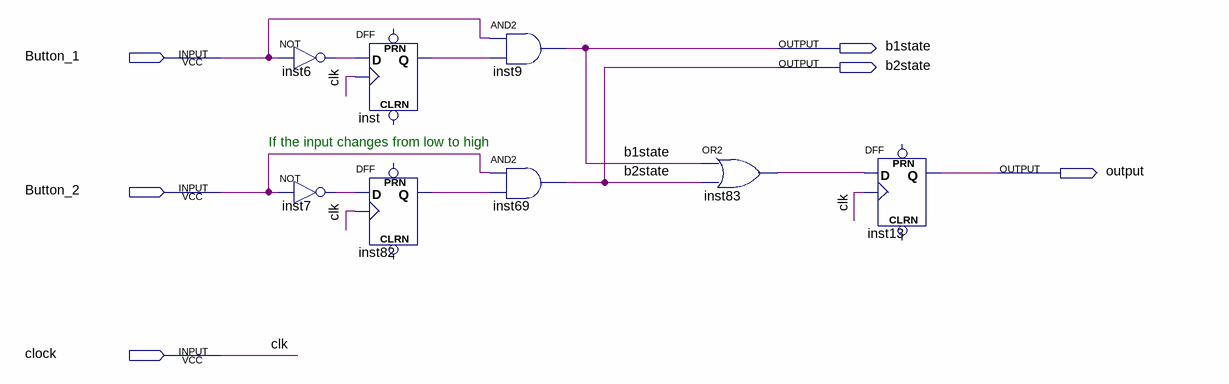
[diagram p0: schematic sheet]
// Quartus schematic ButtonFSMBlock.bdf as structural Verilog: 8 symbols, 6 pins
module ButtonFSMBlock (
  input  Button_1,
  input  Button_2,
  input  clock,
  output b1state,
  output b2state,
  output \output 
);

  wire inst6_out, inst7_out, inst82_q, inst83_out, inst_q;

  not inst6 (inst6_out, Button_1);
  not inst7 (inst7_out, Button_2);
  DFF inst (.CLK(clock), .D(inst6_out), .Q(inst_q));  // open: CLRN, PRN
  DFF inst82 (.CLK(clock), .D(inst7_out), .Q(inst82_q));  // open: CLRN, PRN
  and inst9 (b1state, Button_1, inst_q);
  and inst69 (b2state, Button_2, inst82_q);
  or inst83 (inst83_out, b1state, b2state);
  DFF inst13 (.CLK(clock), .D(inst83_out), .Q(\output ));  // open: CLRN, PRN

  // Other names for the same wires on the sheet: clk = clock

  // Notes on the sheet:
  //   If the input changes from low to high
endmodule
